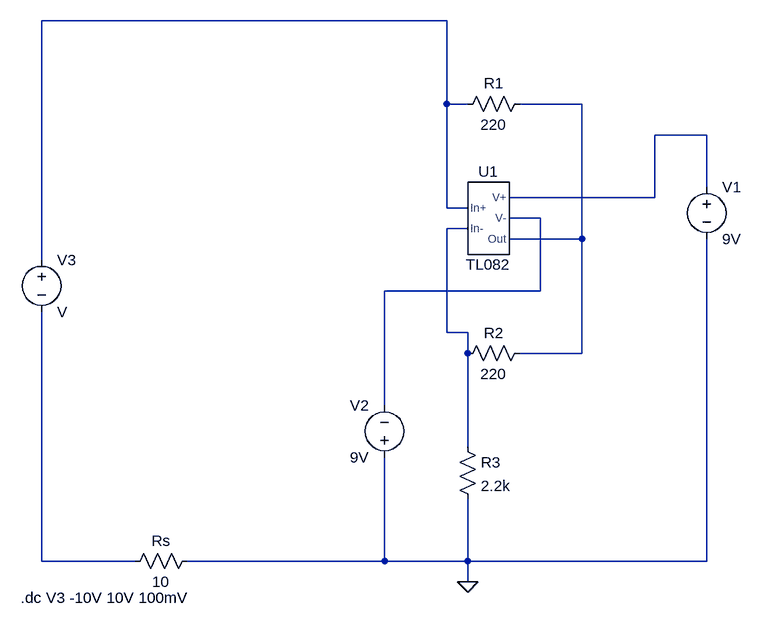
[diagram p0: schematic Negative Resistance (copy).asc]
Negative Resistance (copy).asc, the LTspice schematic file:
Version 4
SHEET 1 880 760
WIRE 416 -144 -208 -144
WIRE 416 -16 416 -144
WIRE 448 -16 416 -16
WIRE 624 -16 528 -16
WIRE 816 32 736 32
WIRE 816 112 816 32
WIRE 736 128 736 32
WIRE 736 128 512 128
WIRE 416 144 416 -16
WIRE 448 144 416 144
WIRE 560 160 512 160
WIRE 448 176 416 176
WIRE 624 192 624 -16
WIRE 624 192 512 192
WIRE -208 224 -208 -144
WIRE 560 272 560 160
WIRE 560 272 320 272
WIRE 416 336 416 176
WIRE 448 336 416 336
WIRE 448 368 448 336
WIRE 624 368 624 192
WIRE 624 368 528 368
WIRE 320 448 320 272
WIRE 448 512 448 368
WIRE -208 688 -208 304
WIRE -64 688 -208 688
WIRE 320 688 320 528
WIRE 320 688 16 688
WIRE 448 688 448 592
WIRE 448 688 320 688
WIRE 816 688 816 192
WIRE 816 688 448 688
WIRE 448 720 448 688
FLAG 448 720 0
SYMBOL TL082 480 160 R0
SYMATTR InstName U1
SYMBOL res 544 -32 R90
WINDOW 0 0 56 VBottom 2
WINDOW 3 32 56 VTop 2
SYMATTR InstName R1
SYMATTR Value 220
SYMATTR SpiceLine tol=5
SYMBOL res 544 352 R90
WINDOW 0 0 56 VBottom 2
WINDOW 3 32 56 VTop 2
SYMATTR InstName R2
SYMATTR Value 220
SYMATTR SpiceLine tol=5
SYMBOL res 432 496 R0
SYMATTR InstName R3
SYMATTR Value 2.2k
SYMATTR SpiceLine tol=5
SYMBOL voltage 320 544 R180
WINDOW 0 24 96 Left 2
WINDOW 3 24 16 Left 2
WINDOW 123 0 0 Left 0
WINDOW 39 0 0 Left 0
SYMATTR InstName V2
SYMATTR Value 9V
SYMBOL voltage 816 96 R0
WINDOW 123 0 0 Left 0
WINDOW 39 0 0 Left 0
SYMATTR InstName V1
SYMATTR Value 9V
SYMBOL res 32 672 R90
WINDOW 0 0 56 VBottom 2
WINDOW 3 32 56 VTop 2
SYMATTR InstName Rs
SYMATTR Value 10
SYMATTR SpiceLine tol=5
SYMBOL voltage -208 208 R0
SYMATTR InstName V3
TEXT -240 744 Left 2 !.dc V3 -10V 10V 100mV

The netlist it stands for:
* Negative Resistance (copy).asc
XU1 N001 N005 N003 N004 N002 TL082  ; pins In+ In- V+ V- Out
R1 N002 N001 220 tol=5
R2 N002 N005 220 tol=5
R3 N005 0 2.2k tol=5
V2 0 N004 9V
V1 N003 0 9V
Rs 0 N006 10 tol=5
V3 N001 N006 V
.dc V3 -10V 10V 100mV
.lib TL082.sub
.backanno
.end